# EAGLE design smart_mop (EAGLE 9.6.2)
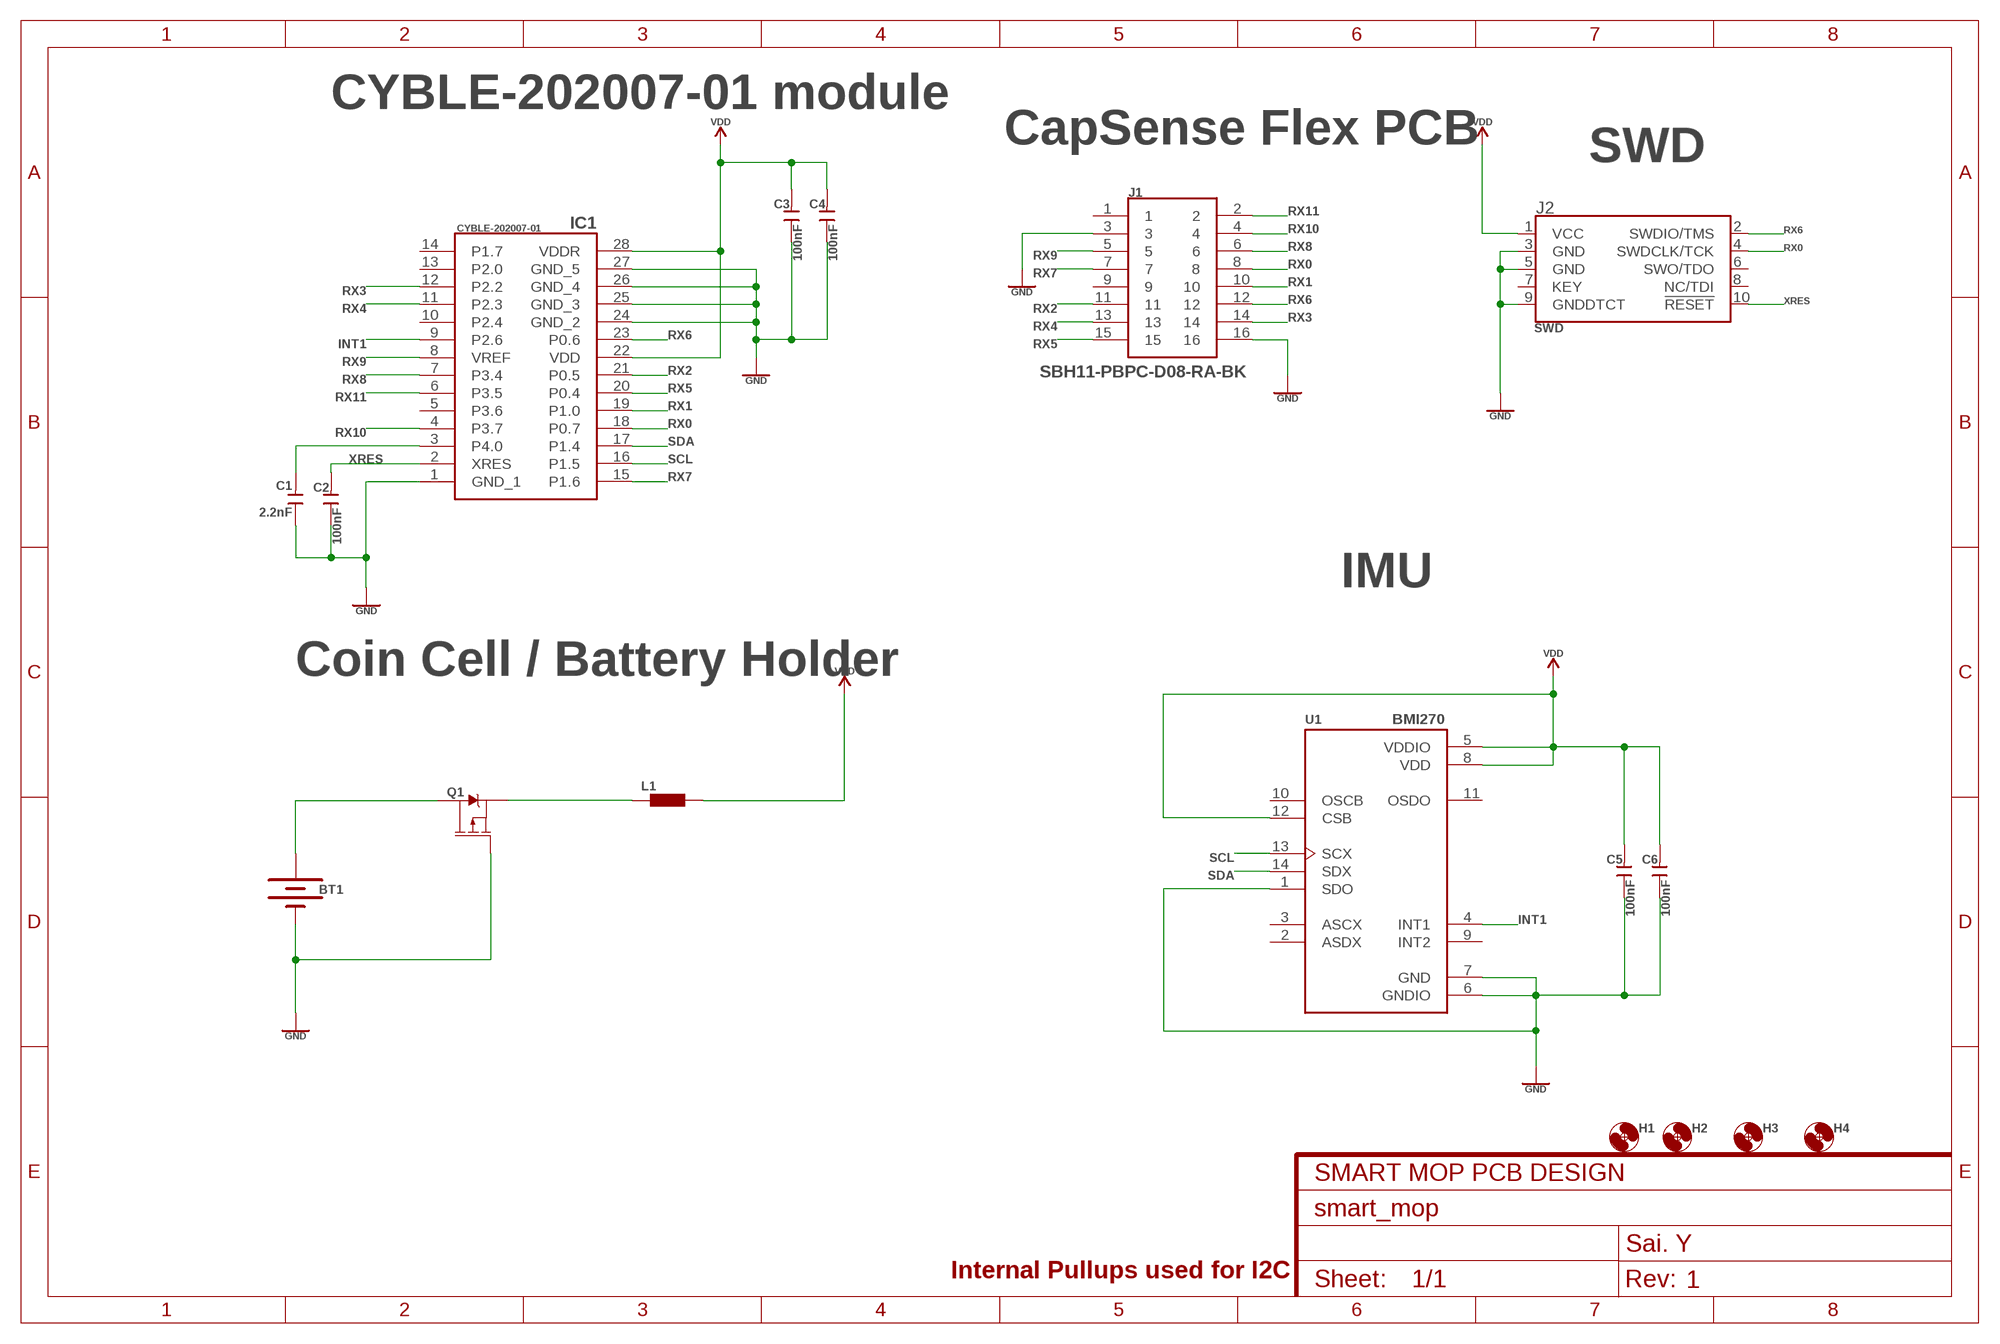
[diagram p0: schematic, sheet 1]
FRAME1 (FRAME-A4L): CNAME: SMART MOP PCB DESIGN; CREVISION: 1; DESIGNER: Sai. Y

## Parts
BT1  BATTERY-20MM_SMD  [BATTCON_20MM]
C1  2.2nF  CERAMIC-2.2NF-50V-10%-X7R(0402)  [C0402]
C2  100nF  CERAMIC-100NF-25V-10%-X7R(0402)  [C0402]
C3  100nF  CERAMIC-100NF-25V-10%-X7R(0402)  [C0402]
C4  100nF  CERAMIC-100NF-25V-10%-X7R(0402)  [C0402]
C5  100nF  CERAMIC-100NF-25V-10%-X7R(0402)  [C0402]
C6  100nF  CERAMIC-100NF-25V-10%-X7R(0402)  [C0402]
H1  MOUNT-HOLE2.8  [2,8]
H2  MOUNT-HOLE2.8  [2,8]
H3  MOUNT-HOLE2.8  [2,8]
H4  MOUNT-HOLE2.8  [2,8]
IC1  CYBLE-202007-01  [CYBLE20200701]
J1  SBH11-PBPC-D08-RA-BK  [SHDRRA16W64P254_2X8_2782X910X9]
J2  SWD  CORTEX_DEBUG_SMD  [SAMTECH_FTSH-105-01]
L1  BLM15HB121SN1  [0402]
Q1  2.5A/30V/105mΩ  MOSFET_PCH-DMG2307L  [SOT23-3]
U1  BMI270  [XDCR_BMI270]

## Nets
GND: BT1.2(-) C1.1 C2.1 C3.1 C4.1 C5.1 C6.1 IC1.1(GND_1) IC1.24(GND_2) IC1.25(GND_3) IC1.26(GND_4) IC1.27(GND_5) J1.3 J1.16 J2.3(GND) J2.5(GND) J2.9(GNDDTCT) Q1.1(G) U1.1(SDO) U1.6(GNDIO) U1.7(GND)
INT1: IC1.9(P2.6) U1.4(INT1)
N$1: BT1.1(+) Q1.3(D)
N$2: C1.2 IC1.3(P4.0)
N$4: L1.1 Q1.2(S)
RX0: IC1.18(P0.7) J1.8 J2.4(SWDCLK/TCK)
RX1: IC1.19(P1.0) J1.10
RX2: IC1.21(P0.5) J1.11
RX3: IC1.12(P2.2) J1.14
RX4: IC1.11(P2.3) J1.13
RX5: IC1.20(P0.4) J1.15
RX6: IC1.23(P0.6) J1.12 J2.2(SWDIO/TMS)
RX7: IC1.15(P1.6) J1.7
RX8: IC1.7(P3.4) J1.6
RX9: IC1.8(VREF) J1.5
RX10: IC1.4(P3.7) J1.4
RX11: IC1.6(P3.5) J1.2
SCL: IC1.16(P1.5) U1.13(SCX)
SDA: IC1.17(P1.4) U1.14(SDX)
VDD: C3.2 C4.2 C5.2 C6.2 IC1.22(VDD) IC1.28(VDDR) J2.1(VCC) L1.2 U1.5(VDDIO) U1.8(VDD) U1.12(CSB)
XRES: C2.2 IC1.2(XRES) J2.10(!RESET)
Unconnected: IC1.5(P3.6) IC1.10(P2.4) IC1.13(P2.0) IC1.14(P1.7) J1.1 J1.9 J2.6(SWO/TDO) J2.7(KEY) J2.8(NC/TDI) U1.2(ASDX) U1.3(ASCX) U1.9(INT2) U1.10(OSCB) U1.11(OSDO)

## Notes on the sheet
- CYBLE-202007-01 module
- CapSense Flex PCB
- SWD
- IMU
- Coin Cell / Battery Holder
- Internal Pullups used for I2C

## Library data of the parts
BT1 = SparkFun-Batteries:BATTERY: Battery - Single Cell A variety of battery chemistries, sizes, and footprints. Device List: 20MM_PTH - Coin Cell Battery Holder - 20mm (PTH) <https://www.sparkfun.com/products/783> 6.8MM_PTH - Coin Cell Battery Holder - 6.8MM(SMD) <https://www.digikey.com/product-detail/en/seiko-instruments/MS621FE-FL11E/728-1057-ND/1889208?WT.srch=1&gclid=CNOQ5a6LzdQCFZS2wAodXCkE0g> 12MM_SMD - Coin Cell Battery Holder - 12mm (SMD) <https://www.sparkfun.com/products/10592> 12MM_PTH - Coin Cell Battery Holder - 12mm (PTH) <https://www.sparkfun.com/products/7948> 20MM_SMD - 20mm Coin Cell Battery Holder (SMD) (2 legs) Used on the Big Time Watch Kit <https://www.sparkfun.com/products/11734> 20MM_SMD_4LEGS - Coin Cell Battery Holder - 20mm (SMD) <https://www.sparkfun.com/products/11892> 20MM_SMD_4LEGS_OVERPASTE - Coin Cell Battery Holder - 20mm (SMD) <https://www.sparkfun.com/products/11892> (Over-paste on the legs) 24.5MM_PTH - Coin Cell Battery Holder - 24.5mm (PTH) <https://www.sparkfun.com/products/8863> 9V - 9V Battery Holder - PC Mount Used on the SparkFun SparkPunk Sound Kit <https://www.sparkfun.com/products/11177> and SparkFun SparkPunk Sequencer Kit <https://www.sparkfun.com/products/12707> 18650 - Battery Holder - 18650 (PTH) <https://www.sparkfun.com/products/13113> AA - Battery Holder - 1xAA (PTH) <https://www.sparkfun.com/products/7949> AAA - Battery Holder - 1xAAA (PTH) <https://www.sparkfun.com/products/12718> AA_KIT - Battery Holder - 1xAA (PTH) <https://www.sparkfun.com/products/7949> Special kit package - pads only have exposed copper on one side of the board. AAA_KIT - Battery Holder - 1xAAA (PTH) <https://www.sparkfun.com/products/12718> Special kit package - pads only have exposed copper on one side of the board.; PROD_ID: BATT-11519
C1 = OPL_Capacitor:CERAMIC-2.2NF-50V-10%-X7R(0402): 302010022; MPN: CC0402KRX7R9BB222; VALUE: 2.2nf
C2-C6 = OPL_Capacitor:CERAMIC-100NF-25V-10%-X7R(0402): 302010024; MPN: CC0402KRX7R8BB104; VALUE: 100nf
H1-H4 = holes:MOUNT-HOLE: MOUNTING HOLE with drill center marker
IC1 = SamacSys_Parts:CYBLE-202007-01: CYPRESS - INFINEON TECHNOLOGIES - CYBLE-202007-01 - Bluetooth 4.2, Class 1 Module, 1.71V to 5.5V Supply, 400m Range, 1Mbps, -93dBm Sensitivity Source: Datasheet <https://componentsearchengine.com/Datasheets/2/CYBLE-202007-01.pdf>; DESCRIPTION: CYPRESS - INFINEON TECHNOLOGIES - CYBLE-202007-01 - Bluetooth 4.2, Class 1 Module, 1.71V to 5.5V Supply, 400m Range, 1Mbps, -93dBm Sensitivity; HEIGHT: 2mm; MANUFACTURER_NAME: Infineon; MANUFACTURER_PART_NUMBER: CYBLE-202007-01; MOUSER_PART_NUMBER: 727-CYBLE-202007-01; MOUSER_PRICE-STOCK: https://www.mouser.co.uk/ProductDetail/Infineon-Cypress/CYBLE-202007-01?qs=u4fy%2FsgLU9Pk4mHCaJYMQA%3D%3D
J1 = SamacSys_Parts:SBH11-PBPC-D08-RA-BK: CONN HEADER R/A 16POS 2.54MM Source: Datasheet <https://s3.amazonaws.com/catalogspreads-pdf/PAGE122 .100 SBH11 SERIES MALE BOX HDR ST RA SMT.pdf>; DESCRIPTION: CONN HEADER R/A 16POS 2.54MM; HEIGHT: 9.3mm; MANUFACTURER_NAME: Sullins; MANUFACTURER_PART_NUMBER: SBH11-PBPC-D08-RA-BK
J2 = SparkFun-Connectors:CORTEX_DEBUG: Cortex Debug Connector - 10 pin Supports JTAG debug, Serial Wire debug, and Serial Wire Viewer. PTH and SMD connector options available. General Connector Information <http://infocenter.arm.com/help/topic/com.arm.doc.faqs/attached/13634/cortex_debug_connectors.pdf> Products: PTH Connector <http://www.digikey.com/product-detail/en/cnc-tech/3220-10-0100-00/1175-1627-ND/3883661> -via Digi-Key SparkFun PSoc <https://www.sparkfun.com/products/13229> SparkFun T <https://www.sparkfun.com/products/13810>
L1 = inductors:BLM15H: EMIFIL (R) Chip Ferrite Bead for GHz Noise Source: http://www.murata.com/ Ferrite Bead BLM15H.pdf
Q1 = SparkFun-DiscreteSemi:MOSFET_PCH: P-channel MOSFETs Voltage controlled devices that allow control of high current outputs. SparkFun Products: SparkFun ESP32 Thing <https://www.sparkfun.com/products/13907> SparkFun ESP8266 Thing <https://www.sparkfun.com/products/13231>; PROD_ID: TRANS-11308
U1 = BMI270:BMI270: IMU ACCEL/GYRO I2C/SPI 14LGA Check availability <https://pricing.snapeda.com/parts/BMI270/Bosch%20Sensortec/view-part?ref=eda>; AVAILABILITY: In Stock; DESCRIPTION: Accelerometer, Gyroscope, 6 Axis Sensor I²C, SPI Output; MF: Bosch Sensortec; MP: BMI270; PACKAGE: LGA-14 Bosch Sensortec; PRICE: None; PURCHASE-URL: https://pricing.snapeda.com/search/part/BMI270/?ref=eda

## Board
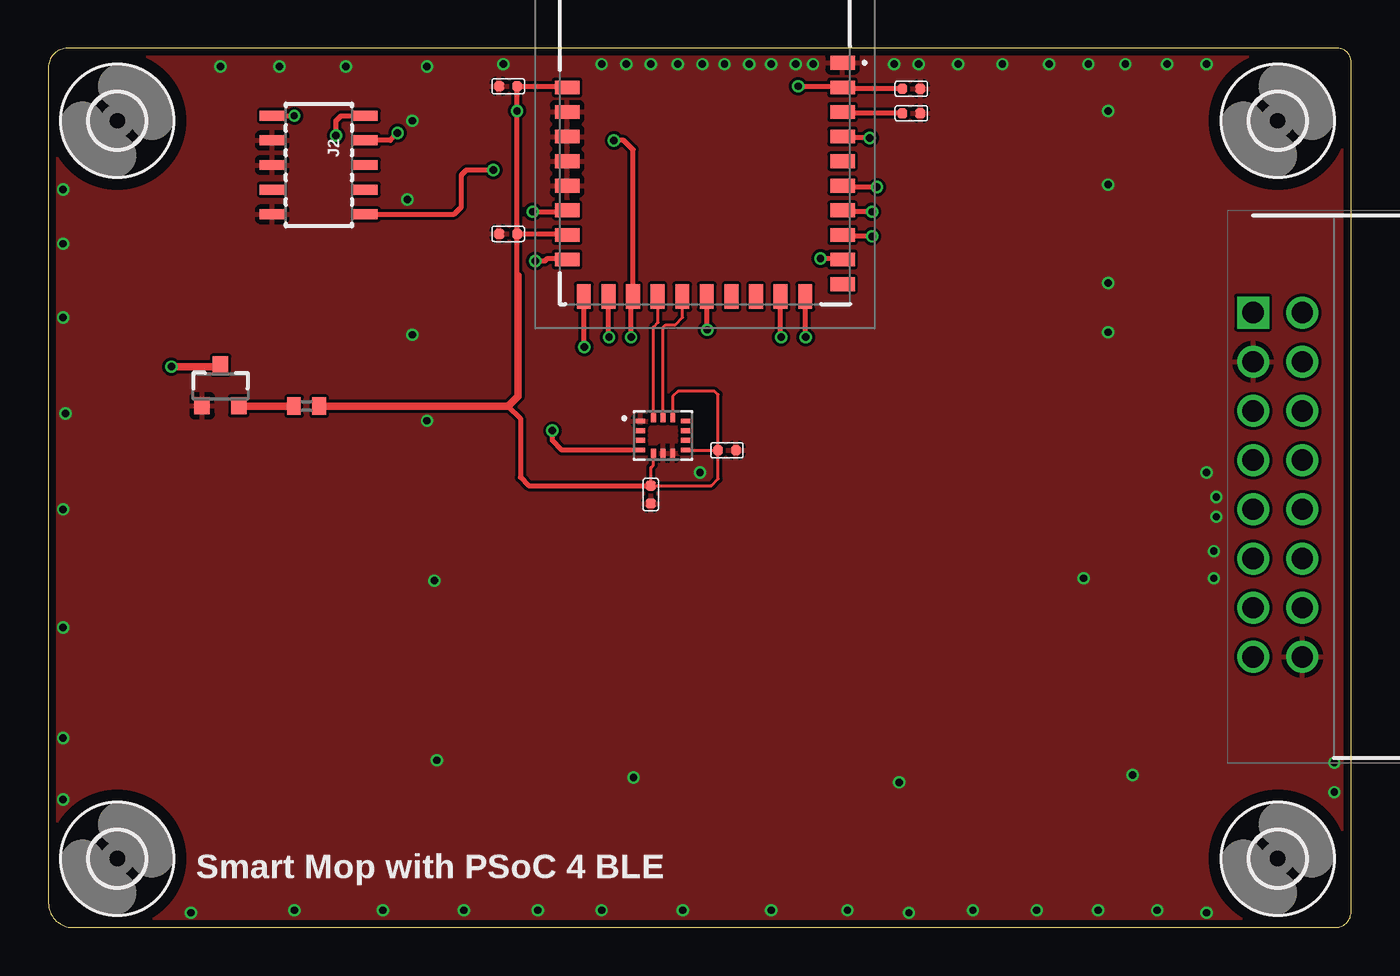
[diagram p1: board, top side]
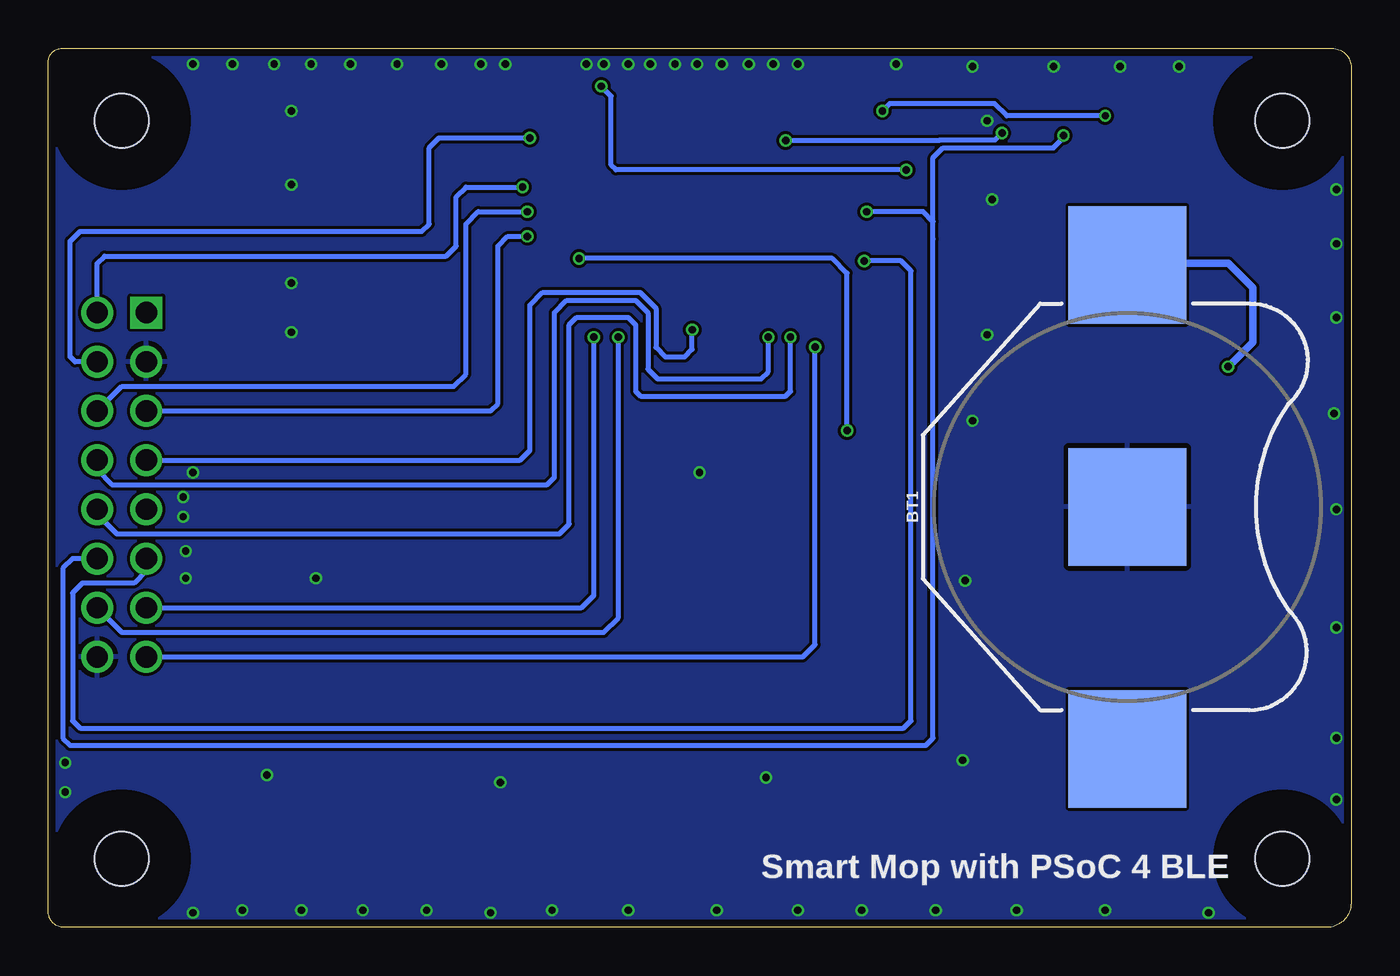
[diagram p2: board, bottom side, seen from below]

Size 67.29 x 45.39 mm. Coordinates in mm from the lower left corner, seen from the top.
Outline: 1.27,0 66.5,0 arc90 67.29,0.79 67.29,44.69 arc90 66.59,45.39 0.89,45.39 arc80 0,44.5 0,1.27 arc90 1.27,0
Copper layers (1*16): Top 0.035559375mm / dielectric 1.6mm / Bottom 0.035559375mm
Design rules "oshpark-2layer": minimum track width 6mil, minimum drill 10mil, track to track 6mil, track to pad 6mil, pad to pad 6mil, via to via 6mil, smd to smd 6mil, copper to edge 15mil, drill to drill 6mil, minimum pad ring 5mil, minimum via ring 5mil, stop-mask expansion 2.5mil, vias tented up to drill 0mil, thermal gap 10mil

### Footprints (pad centres in the part's own frame; a part is rotated, then mirrored left to right if it is on the bottom)
BATTCON_20MM = smd 6.07 x 6.07: 1 -12.5,0; 2 0,0; 3 12.5,0
C0402 = smd 0.5 x 0.5: 1 0,0.463; 2 0,-0.463
2,8 = hole 2.8: 0,0
CYBLE20200701 = smd 1.27 x 0.71: 1 7.115,0.96; 2 7.115,-0.31; 3 7.115,-1.58; 4 7.115,-2.85; 5 7.115,-4.12; 6 7.115,-5.39; 7 7.115,-6.66; 8 7.115,-7.93; 9 7.115,-9.2; 10 7.115,-10.47; 21 -7.115,-9.2; 22 -7.115,-7.93; 23 -7.115,-6.66; 24 -7.115,-5.39; 25 -7.115,-4.12; 26 -7.115,-2.85; 27 -7.115,-1.58; 28 -7.115,-0.31 | smd 0.71 x 1.27: 11 5.18,-11.115; 12 3.91,-11.115; 13 2.64,-11.115; 14 1.37,-11.115; 15 0.1,-11.115; 16 -1.17,-11.115; 17 -2.44,-11.115; 18 -3.71,-11.115; 19 -4.98,-11.115; 20 -6.25,-11.115
SHDRRA16W64P254_2X8_2782X910X9 = drill 1.1 pad 1.65 square: 1 0,0 | drill 1.1 pad 1.65: 2 0,2.54; 3 2.54,0; 4 2.54,2.54; 5 5.08,0; 6 5.08,2.54; 7 7.62,0; 8 7.62,2.54; 9 10.16,0; 10 10.16,2.54; 11 12.7,0; 12 12.7,2.54; 13 15.24,0; 14 15.24,2.54; 15 17.78,0; 16 17.78,2.54
SAMTECH_FTSH-105-01 = smd 0.508 x 1.27: 1 -2.54,-2.413; 2 -2.54,2.413; 3 -1.27,-2.413; 4 -1.27,2.413; 5 0,-2.413; 6 0,2.413; 7 1.27,-2.413; 8 1.27,2.413; 9 2.54,-2.413; 10 2.54,2.413
0402 = smd 0.7 x 0.9: 1 -0.65,0; 2 0.65,0
SOT23-3 = smd 0.8 x 0.9: 1 -0.95,-1; 2 0.95,-1; 3 0,1.1
XDCR_BMI270 = smd 0.475 x 0.25: 1 -1.163,0.75; 2 -1.163,0.25; 3 -1.163,-0.25; 4 -1.163,-0.75; 8 1.163,-0.75; 9 1.163,-0.25; 10 1.163,0.25; 11 1.163,0.75 | smd 0.25 x 0.475: 5 -0.5,-0.912; 6 0,-0.912; 7 0.5,-0.912; 12 0.5,0.912; 13 0,0.912; 14 -0.5,0.912

### Placement (x,y rotation side)
BT1  11.56,21.72 270 bottom
C1  44.58,42.04 270 top
C2  44.58,43.31 270 top
C3  23.75,35.81 90 top
C4  23.75,43.43 90 top
C5  35.05,24.64 270 top
C6  31.11,22.35 180 top
H1  3.56,41.66 0 top
H2  3.56,3.56 0 top
H3  63.5,41.66 0 top
H4  63.5,3.56 0 top
IC1  33.91,43.69 0 top
J1  62.23,31.75 270 top
J2  13.97,39.37 270 top
L1  13.34,26.92 0 top
Q1  8.89,27.94 0 top
U1  31.75,25.4 0 top

### Tracks (layer width: path | path; a pad name or v marks a point on that pad's centre or on a via)
GND  (via drill 0.38)
  other vias: 33.66,23.5 8.89,44.45 28.57,44.58 29.84,44.58 31.11,44.58 32.51,44.58 33.78,44.58 34.92,44.58 36.2,44.58 37.34,44.58 38.61,44.58 39.5,44.58 43.69,44.58 44.96,44.58 46.99,44.58 49.28,44.58 51.69,44.58 53.72,44.58 55.63,44.58 57.78,44.58 59.82,44.58 66.42,8.51 66.42,6.99 60.2,19.43 60.2,18.03 60.33,22.23 60.33,21.21 59.82,23.5 59.82,0.76 57.28,0.89 54.23,0.89 51.05,0.89 47.75,0.89 44.45,0.76 41.27,0.89 37.34,0.89 32.77,0.89 28.57,0.89 25.27,0.89 21.46,0.89 17.27,0.89 12.7,0.89 7.37,0.76 0.76,6.6 0.76,9.78 0.76,15.49 0.76,21.59 0.89,26.54 0.76,31.5 0.76,35.31 0.76,38.1 11.94,44.45 15.37,44.45 19.56,44.45 23.5,44.58 18.8,41.66 18.54,37.59 18.8,30.61 19.56,26.16 19.94,17.91 20.07,8.64 30.23,7.75 43.94,7.49 56.01,7.87 54.74,42.16 54.74,38.35 54.74,33.27 54.74,30.73 53.47,18.03
  pour Top: -15.24,-10.16 -15.24,46.88 arc-45 -15.17,47.06 -12.7,49.53 84.98,49.53 arc-45 85.16,49.46 92.71,41.91 92.71,-1.16 arc-45 92.64,-1.34 77.47,-16.51 -8.78,-16.51 arc-45 -8.96,-16.44
  pour Bottom: -16.51,-16.51 -16.51,46.88 arc-45 -16.44,47.06 -12.7,50.8 90.06,50.8 arc-45 90.24,50.73 105.41,35.56 105.41,0.11 arc-45 105.34,-0.07 83.82,-21.59 -11.32,-21.59 arc-45 -11.5,-21.52
INT1  (via drill 0.38)
  Top 0.254: U1.4 26.53,24.65 26.04,25.15 v26.04,25.65 | v39.88,34.54 40.97,34.54 IC1.9
  Bottom 0.254: v26.04,25.65 26.04,33.78 26.8,34.54 v39.88,34.54
N$1  (via drill 0.38)
  Top 0.381: v6.35,28.96 8.81,28.96 Q1.3
  Bottom 0.381: BT1.1 11.48,34.29 6.35,34.29 5.08,33.02 5.08,30.23 v6.35,28.96
N$2
  Top 0.254: C1.2 41.09,42.04 IC1.3
N$4
  Top 0.381: L1.1 9.86,26.92 Q1.2
RX0  (via drill 0.38)
  Top 0.254: v30.1,30.48 30.1,32.47 IC1.18 30.2,40.16 29.72,40.64 v29.21,40.64 | v18.03,41.02 17.65,40.64 J2.4
  Bottom 0.254: J1.8 64.77,23.62 64.01,22.86 41.53,22.86 41.15,23.24 41.15,31.75 40.51,32.38 36.96,32.38 36.32,31.75 36.32,28.83 35.81,28.32 30.48,28.32 30.1,28.7 v30.1,30.48 | v29.21,40.64 21.28,40.64 21.25,40.66 18.39,40.66 v18.03,41.02
RX1  (via drill 0.38)
  Top 0.254: v28.96,30.48 28.93,30.51 IC1.19
  Bottom 0.254: J1.10 64.77,21.34 63.75,20.32 40.89,20.32 40.39,20.83 40.39,31.11 40.01,31.5 37.34,31.5 36.96,31.11 36.96,27.69 36.7,27.43 29.21,27.43 28.96,27.69 v28.96,30.48
RX2  (via drill 0.38)
  Top 0.254: v25.15,34.42 25.65,34.42 25.78,34.54 26.74,34.54 IC1.21
  Bottom 0.254: J1.11 62.23,18.41 62.87,17.78 65.53,17.78 66.04,17.27 66.04,10.67 65.66,10.29 23.11,10.29 22.73,10.67 22.73,33.91 23.24,34.42 v25.15,34.42
RX3  (via drill 0.38)
  Top 0.254: v37.85,30.48 37.82,30.51 IC1.12
  Bottom 0.254: J1.14 63.5,15.24 38.61,15.24 37.85,16 v37.85,30.48
RX4  (via drill 0.38)
  Top 0.254: v39.12,30.48 39.12,32.55 IC1.11
  Bottom 0.254: v39.12,30.48 39.12,17.14 39.75,16.51 J1.13
RX5  (via drill 0.38)
  Top 0.254: v27.69,29.97 27.66,30 IC1.20
  Bottom 0.254: J1.15 28.32,13.97 27.69,14.61 v27.69,29.97
RX6  (via drill 0.38)
  Top 0.254: v25.02,36.96 26.72,36.96 IC1.23 | v14.86,40.89 14.86,41.66 15.11,41.91 J2.2
  Bottom 0.254: J1.12 66.04,19.05 66.55,18.54 66.55,9.78 66.17,9.4 21.97,9.4 21.59,9.78 21.59,35.56 21.59,36.45 | 21.59,36.45 22.1,36.96 v25.02,36.96 | v14.86,40.89 14.86,40.77 15.37,40.26 21.08,40.26 21.59,39.75 21.59,36.45
RX7  (via drill 0.38)
  Top 0.254: v34.04,30.86 34.01,30.89 IC1.15
  Bottom 0.254: J1.7 42.93,24.13 42.42,24.64 42.42,32.13 41.76,32.79 36.73,32.79 35.92,31.98 35.92,29.95 35.43,29.46 34.42,29.46 34.04,29.84 v34.04,30.86
RX8  (via drill 0.38)
  Top 0.254: v42.55,36.96 41.09,36.96 IC1.7
  Bottom 0.254: J1.6 63.5,27.94 46.35,27.94 45.72,28.57 45.72,36.32 45.09,36.96 v42.55,36.96
RX9  (via drill 0.38)
  Top 0.254: v42.55,35.69 41.09,35.69 IC1.8
  Bottom 0.254: J1.5 44.45,26.67 44.07,27.05 44.07,35.18 43.56,35.69 v42.55,35.69
RX10  (via drill 0.38)
  Top 0.254: v42.42,40.77 41.09,40.77 IC1.4
  Bottom 0.254: J1.4 65.91,29.21 66.17,29.46 66.17,35.43 65.66,35.94 48.01,35.94 47.62,36.32 47.62,40.26 47.12,40.77 v42.42,40.77
RX11  (via drill 0.38)
  Top 0.254: v42.8,38.23 41.09,38.23 IC1.6
  Bottom 0.254: J1.2 64.77,34.29 64.39,34.67 46.74,34.67 46.23,35.18 46.23,37.72 45.72,38.23 v42.8,38.23
SCL
  Top 0.152: U1.13 31.75,30.99 31.88,31.11 32.38,31.11 32.77,31.5 32.77,32.55 IC1.16
SDA
  Top 0.152: U1.14 31.25,31 31.5,31.24 31.5,32.55 IC1.17
VDD  (via drill 0.35, 0.38)
  Top 0.152: U1.5 31.25,23.88 31.11,23.75 C6.2 34.24,22.81 34.59,23.16 C5.2 | U1.8 34.58,24.65 C5.2 | C5.2 34.59,27.51 34.42,27.69 32.51,27.69 32.25,27.42 U1.12 | 24.26,33.02 24.21,33.07
  Top 0.254: IC1.28 26.74,43.43 C4.2 v24.21,42.16 C3.2 | C3.2 26.74,35.81 IC1.22 | 24.21,33.07 C3.2 | 23.75,26.92 24.38,26.29 24.38,23.24 24.81,22.81 C6.2 | J2.1 v12.7,41.91
  Top 0.381: L1.2 23.75,26.92 24.26,27.43 24.26,33.02 24.26,33.66
  Bottom 0.254: v12.7,41.91 17.78,41.91 18.41,42.55 23.83,42.55 v24.21,42.16
XRES  (via drill 0.38)
  Top 0.254: C2.2 41.09,43.31 IC1.2 40.97,43.43 v38.73,43.43 | J2.10 20.95,36.83 21.34,37.21 21.34,38.86 21.59,39.12 v22.99,39.12
  Bottom 0.254: v22.99,39.12 37.97,39.12 38.23,39.37 38.23,42.93 v38.73,43.43

### Text on the board
tNames: Smart Mop with PSoC 4 BLE
bNames: Smart Mop with PSoC 4 BLE